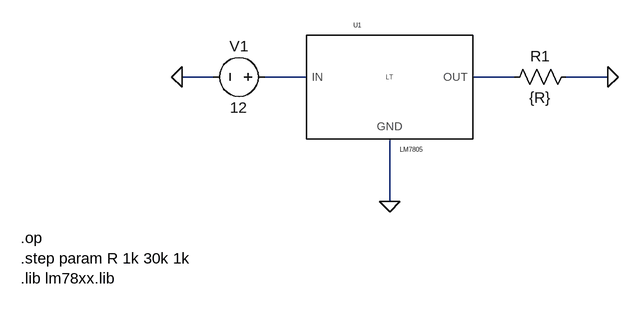
[diagram p0: schematic LM78xx.asc]
LM78xx.asc, the LTspice schematic file:
Version 4
SHEET 1 880 680
WIRE 224 96 176 96
WIRE 368 96 304 96
WIRE 688 96 624 96
WIRE 832 96 768 96
WIRE 496 288 496 192
FLAG 496 288 0
FLAG 832 96 0
FLAG 176 96 0
SYMBOL voltage 320 96 R90
WINDOW 0 -32 56 VBottom 2
WINDOW 3 32 56 VTop 2
WINDOW 123 0 0 Left 0
WINDOW 39 0 0 Left 0
SYMATTR InstName V1
SYMATTR Value 12
SYMBOL res 784 80 R90
WINDOW 0 0 56 VBottom 2
WINDOW 3 32 56 VTop 2
SYMATTR InstName R1
SYMATTR Value {R}
SYMBOL lm7805 496 96 R0
SYMATTR InstName U1
TEXT -72 344 Left 2 !.op\n.step param R 1k 30k 1k\n.lib lm78xx.lib

The netlist it stands for:
* LM78xx.asc
V1 N001 0 12
R1 0 N002 {R}
XU1 N001 0 N002 LM7805  ; pins IN GND OUT
.op
.step param R 1k 30k 1k
.lib lm78xx.lib
.lib lm78xx.lib
.backanno
.end